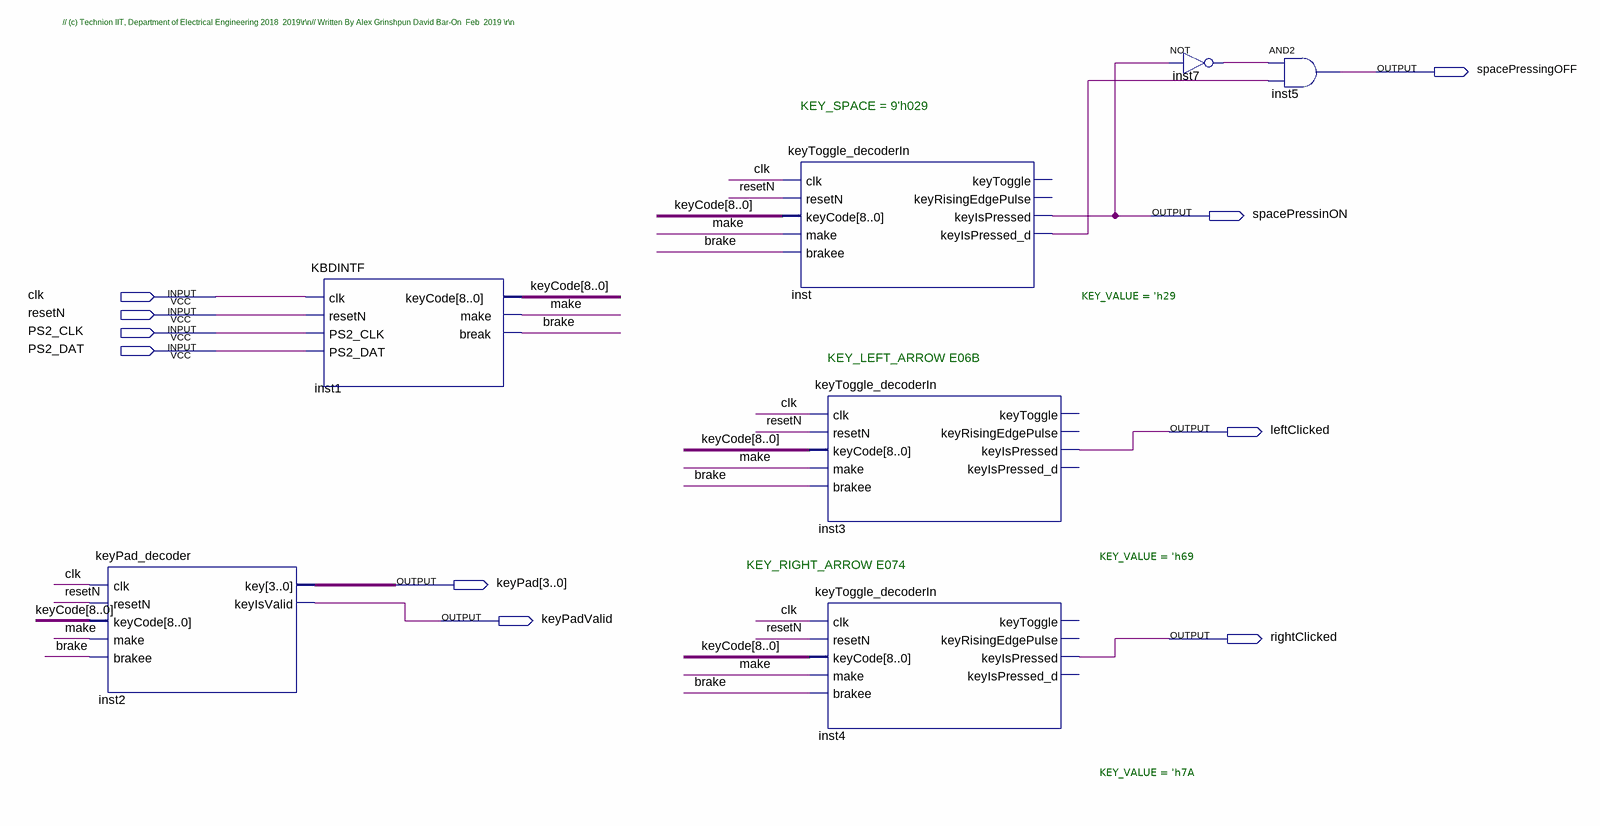
[diagram p0: schematic sheet]
// Quartus schematic TOP_KBD_DEMOLPM.bdf as structural Verilog: 7 symbols, 10 pins
module TOP_KBD_DEMOLPM (
  input  clk,
  input  resetN,
  input  PS2_CLK,
  input  PS2_DAT,
  output spacePressingOFF,
  output spacePressinON,
  output leftClicked,
  output [3:0] keyPad,
  output keyPadValid,
  output rightClicked
);

  wire brake, inst7_out, inst_keyispressed_d, make;
  wire [8:0] keyCode;

  keyPad_decoder inst2 (
    .clk(clk), .resetN(resetN), .keyCode(keyCode), .make(make), .brakee(brake), .key(keyPad),
    .keyIsValid(keyPadValid));
  KBDINTF inst1 (
    .clk(clk), .resetN(resetN), .PS2_CLK(PS2_CLK), .PS2_DAT(PS2_DAT), .keyCode(keyCode), .make(make),
    .\break (brake));
  keyToggle_decoderIn #(.KEY_VALUE('h29)) inst (
    .clk(clk), .resetN(resetN), .keyCode(keyCode), .make(make), .brakee(brake),
    .keyIsPressed(spacePressinON), .keyIsPressed_d(inst_keyispressed_d));  // open: keyToggle, keyRisingEdgePulse
  keyToggle_decoderIn #(.KEY_VALUE('h69)) inst3 (
    .clk(clk), .resetN(resetN), .keyCode(keyCode), .make(make), .brakee(brake), .keyIsPressed(leftClicked));  // open: keyToggle, keyRisingEdgePulse, keyIsPressed_d
  keyToggle_decoderIn #(.KEY_VALUE('h7A)) inst4 (
    .clk(clk), .resetN(resetN), .keyCode(keyCode), .make(make), .brakee(brake), .keyIsPressed(rightClicked));  // open: keyToggle, keyRisingEdgePulse, keyIsPressed_d
  not inst7 (inst7_out, spacePressinON);
  and inst5 (spacePressingOFF, inst7_out, inst_keyispressed_d);

  // Notes on the sheet:
  //   // (c) Technion IIT, Department of Electrical Engineering 2018  2019\r\n// Written By Alex Grinshpun David Bar-On  Feb  2019 \r\n
  //   KEY_SPACE = 9'h029
  //   KEY_LEFT_ARROW E06B
  //   KEY_RIGHT_ARROW E074
endmodule
